# Altium schematic sheet BMS AFE - Thermistors.SchDoc: Title
size B; Organization: Midnight Sun Solar Rayce Car Team; Address1: University of Waterloo; Address2: 200 University Ave W; Address3: Waterloo, ON, Canada; Address4: N2L 3E9; DocumentNumber: 7; SheetNumber: 7; SheetTotal: 7; Website: www.uwmidsun.com; ProjectName: ProjectName
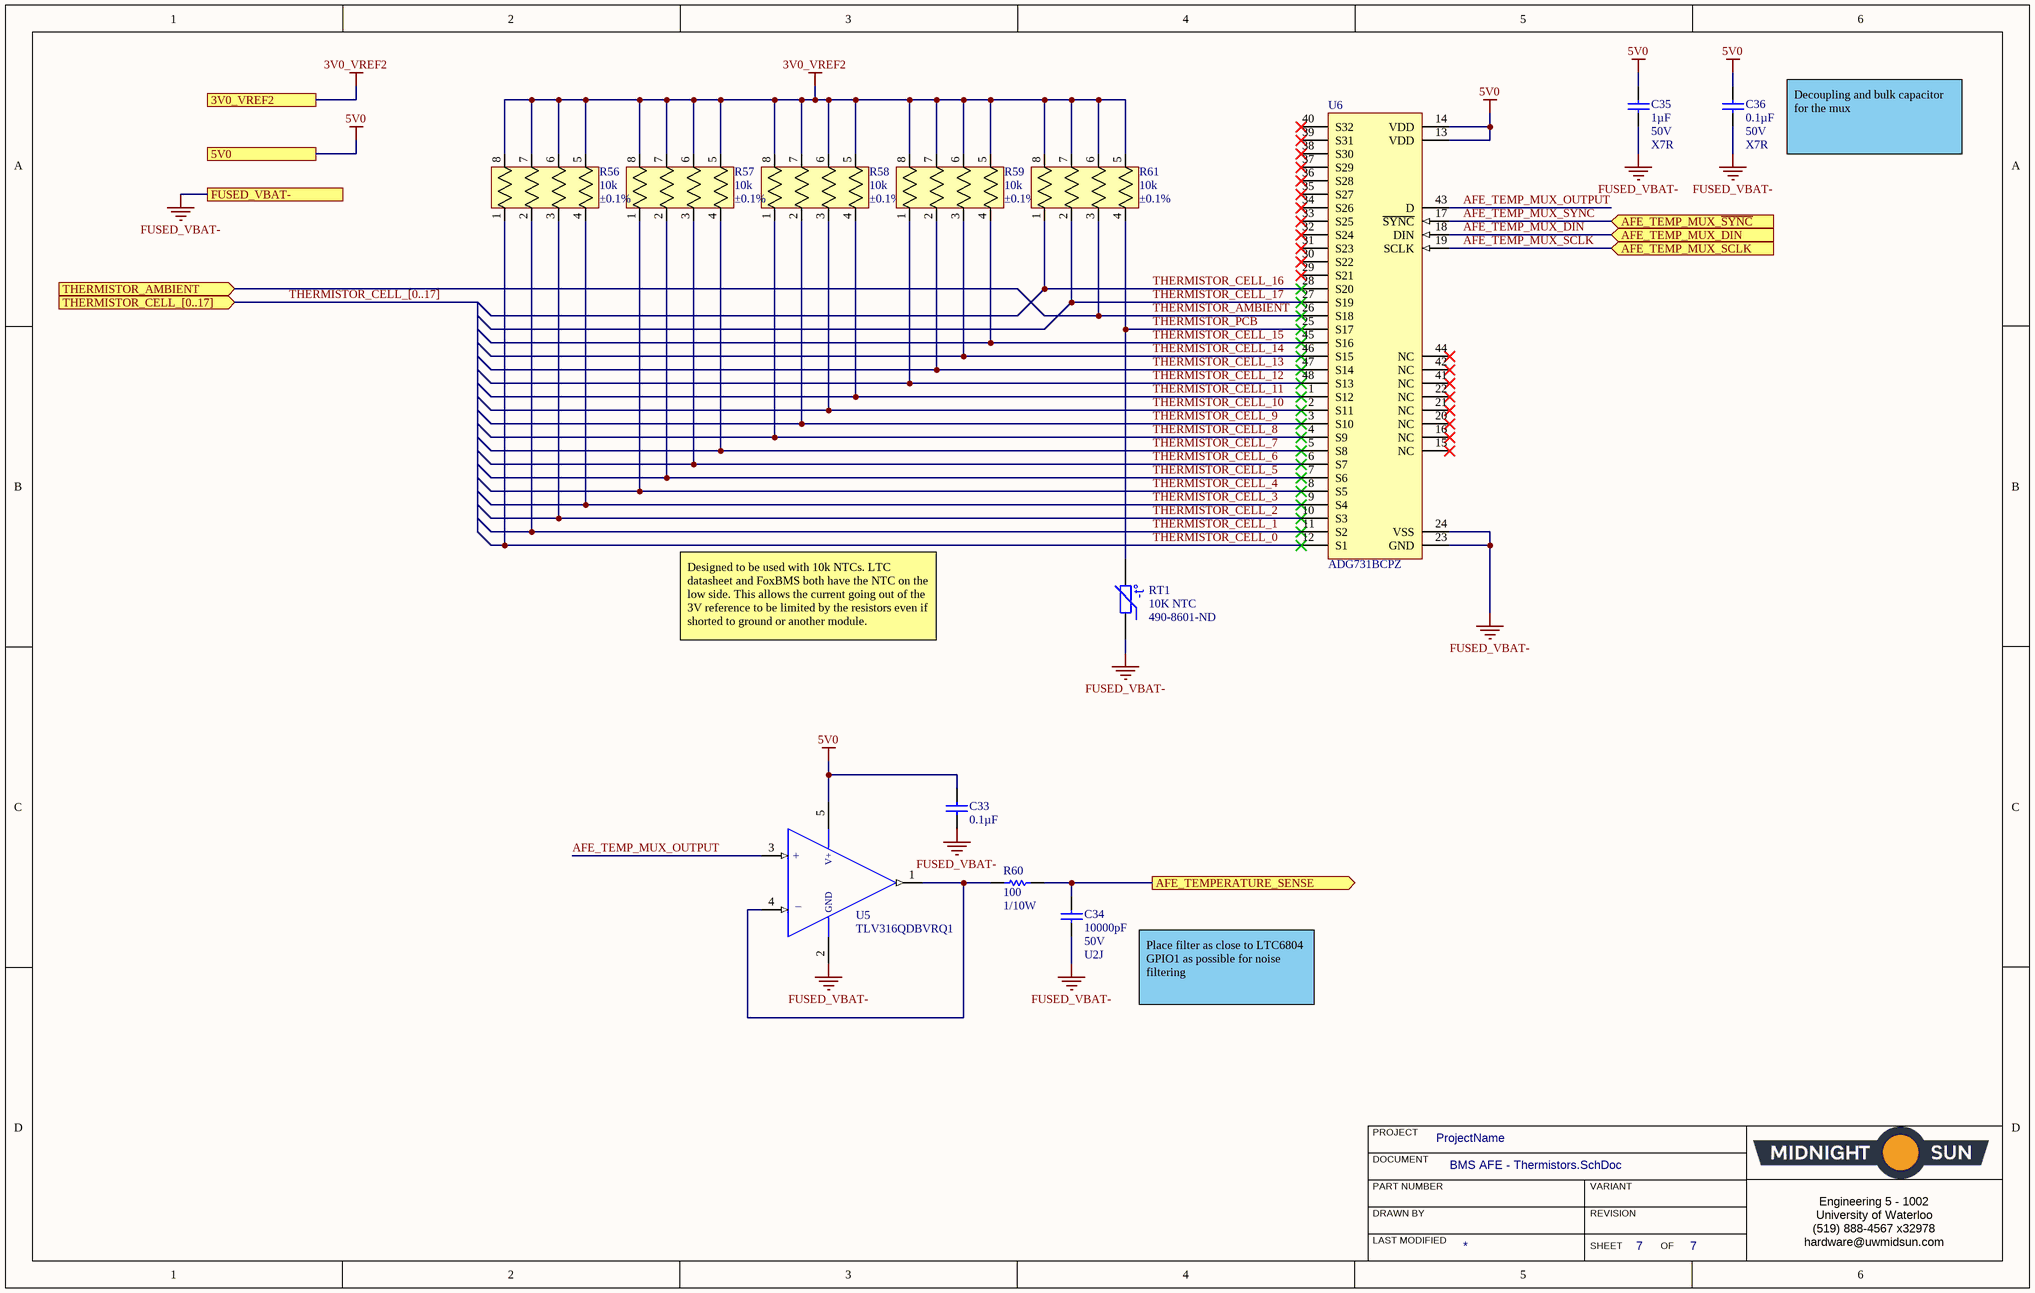
[diagram p0: BMS AFE - Thermistors.SchDoc]

## Parts
C33  Capacitance: 0.1µF  [CAP, 0603]  (hidden comment: CAP CER 0.1UF 50V 10% X7R 0603)
C34  Capacitance: 10000pF  Voltage: 50V  Temperature Coefficient: U2J  [CAP, 0603]  (hidden comment: CAP CER 10nF 50V 5% X7R 0603)
C35  Capacitance: 1µF  Voltage: 50V  Temperature Coefficient: X7R  [CAP, 0603]  (hidden comment: CAP CER 1UF 50V 10% X7R 0603)
C36  Capacitance: 0.1µF  Voltage: 50V  Temperature Coefficient: X7R  [CAP, 0603]  (hidden comment: CAP CER 0.1UF 50V 10% X7R 0603)
R56  Resistance (Ohms): 10k  Tolerance: ±0.1%  [RES ARRAY 4RES 1206]  (hidden comment: RES ARRAY 10K OHM 0.1% 4RES 1206)
R57  Resistance (Ohms): 10k  Tolerance: ±0.1%  [RES ARRAY 4RES 1206]  (hidden comment: RES ARRAY 10K OHM 0.1% 4RES 1206)
R58  Resistance (Ohms): 10k  Tolerance: ±0.1%  [RES ARRAY 4RES 1206]  (hidden comment: RES ARRAY 10K OHM 0.1% 4RES 1206)
R59  Resistance (Ohms): 10k  Tolerance: ±0.1%  [RES ARRAY 4RES 1206]  (hidden comment: RES ARRAY 10K OHM 0.1% 4RES 1206)
R60  Resistance: 100  Power: 1/10W  [RES, 0603]  (hidden comment: RES 100 OHM 1% 1/10W 0603)
R61  Resistance (Ohms): 10k  Tolerance: ±0.1%  [RES ARRAY 4RES 1206]  (hidden comment: RES ARRAY 10K OHM 0.1% 4RES 1206)
RT1  10K NTC  Supplier Part Number 1: 490-8601-ND  [NTC THERMISTOR BEAD]
U5  Manufacturer Part Number 1: TLV316QDBVRQ1  [IC OP AMP GP RR 10MHZ SOT-23-5]  (hidden comment: IC OP AMP GEN PURPOSE RR 10MHZ SOT-23-5)
U6  ADG731BCPZ  [TSQFP50P890X890X160-48M]

## Ports
3V0_VREF2, 5V0, AFE_TEMP_MUX_DIN (in), AFE_TEMP_MUX_SCLK (in), AFE_TEMP_MUX_~{SYNC} (in), AFE_TEMPERATURE_SENSE (out), FUSED_VBAT-, THERMISTOR_AMBIENT (in), THERMISTOR_CELL_[0..17] (in)

## Nets
3V0_VREF2: R56.5 R56.6 R56.7 R56.8 R57.5 R57.6 R57.7 R57.8 R58.5 R58.6 R58.7 R58.8 R59.5 R59.6 R59.7 R59.8 R61.5 R61.6 R61.7 R61.8 ; port 3V0_VREF2
5V0: C33.1 C35.1 C36.1 U5.5(VDD) U6.13(VDD) U6.14(VDD) ; port 5V0
FUSED_VBAT-: C33.2 C34.2 C35.2 C36.2 RT1.1 U5.2(VSS) U6.23(GND) U6.24(VSS) ; port FUSED_VBAT-
AFE_TEMP_MUX_DIN: U6.18(DIN) ; port AFE_TEMP_MUX_DIN
AFE_TEMP_MUX_OUTPUT: U5.3(+IN) U6.43(D)
AFE_TEMP_MUX_~{SYNC}: U6.17(~{SYNC}) ; port AFE_TEMP_MUX_~{SYNC}
AFE_TEMP_MUX_SCLK: U6.19(SCLK) ; port AFE_TEMP_MUX_SCLK
AFE_TEMPERATURE_SENSE: C34.1 R60.2 ; port AFE_TEMPERATURE_SENSE
THERMISTOR_AMBIENT: R61.3 U6.26(S18) ; port THERMISTOR_AMBIENT
THERMISTOR_CELL_0: R56.1 U6.12(S1)
THERMISTOR_CELL_1: R56.2 U6.11(S2)
THERMISTOR_CELL_2: R56.3 U6.10(S3)
THERMISTOR_CELL_3: R56.4 U6.9(S4)
THERMISTOR_CELL_4: R57.1 U6.8(S5)
THERMISTOR_CELL_5: R57.2 U6.7(S6)
THERMISTOR_CELL_6: R57.3 U6.6(S7)
THERMISTOR_CELL_7: R57.4 U6.5(S8)
THERMISTOR_CELL_8: R58.1 U6.4(S9)
THERMISTOR_CELL_9: R58.2 U6.3(S10)
THERMISTOR_CELL_10: R58.3 U6.2(S11)
THERMISTOR_CELL_11: R58.4 U6.1(S12)
THERMISTOR_CELL_12: R59.1 U6.48(S13)
THERMISTOR_CELL_13: R59.2 U6.47(S14)
THERMISTOR_CELL_14: R59.3 U6.46(S15)
THERMISTOR_CELL_15: R59.4 U6.45(S16)
THERMISTOR_CELL_16: R61.1 U6.28(S20)
THERMISTOR_CELL_17: R61.2 U6.27(S19)
THERMISTOR_PCB: R61.4 RT1.2 U6.25(S17)
NetR60_1: R60.1 U5.1(OUTPUT) U5.4(-IN)

Not connected (* = marked no-connect by the designer): U6 15(NC)* 16(NC)* 20(NC)* 21(NC)* 22(NC)* 29(S21)* 30(S22)* 31(S23)* 32(S24)* 33(S25)* 34(S26)* 35(S27)* 36(S28)* 37(S29)* 38(S30)* 39(S31)* 40(S32)* 41(NC)* 42(NC)* 44(NC)*

## Buses and harness runs
bus THERMISTOR_CELL_[0..17] = port THERMISTOR_CELL_[0..17]

## Notes on the sheet
- Decoupling and bulk capacitor for the mux
- Designed to be used with 10k NTCs. LTC datasheet and FoxBMS both have the NTC on the low side. This allows the current going out of the 3V reference to be limited by the resistors even if shorted to ground or another module.
- Place filter as close to LTC6804 GPIO1 as possible for noise filtering
- PROJECT
- DOCUMENT
- DRAWN BY
- LAST MODIFIED
- PART NUMBER
- REVISION
- SHEET
- VARIANT
- OF
- Engineering 5 - 1002
  University of Waterloo
  (519) 888-4567 x32978
  hardware@uwmidsun.com
- (in symbol IC OP AMP GEN PURPOSE RR 10MHZ SOT-23-5) V+; +; GND; _
- (in symbol NTC THERMISTOR 10K 1% BEAD) -t°

## Library data of the parts
C33 C36 = CAP CER 0.1UF 50V 10% X7R 0603: 0.10µF ±10% 50V Ceramic Capacitor X7R 0603 (1608 Metric); Manufacturer 1: AVX Corporation; Manufacturer Part Number 1: 06035C104KAT2A; Supplier 1: Digi-Key; Supplier Part Number 1: 478-5052-1-ND; Packaging: Cut Tape (CT); Part Status: Active; Operating Temperature: -55°C ~ 125°C; Ratings: -; Mounting Type: Surface Mount, MLCC; Package / Case: 0603 (1608 Metric); Size / Dimension: 0.063" L x 0.032" W (1.60mm x 0.81mm); Height - Seated (Max): -; Thickness (Max): 0.035" (0.90mm); Lead Spacing: -; Lead Style: -; ComponentLink1URL: http://datasheets.avx.com/X7RDielectric.pdf; ComponentLink1Description: http://datasheets.avx.com/X7RDielectric.pdf; Tolerance: ±10%
  C33: Voltage: 50V; Temperature Coefficient: X7R
C34 = CAP CER 10nF 50V 5% X7R 0603: 10000pF ±5% 50V Ceramic Capacitor U2J 0603 (1608 Metric); Manufacturer 1: KEMET; Manufacturer Part Number 1: C0603C103J5JAC7867; Supplier 1: Digi-Key; Supplier Part Number 1: 399-13384-1-ND; Packaging: Cut Tape (CT); Part Status: Active; Operating Temperature: -55°C ~ 125°C; Ratings: -; Failure Rate: -; Mounting Type: Surface Mount, MLCC; Package / Case: 0603 (1608 Metric); Size / Dimension: 0.063" L x 0.032" W (1.60mm x 0.80mm); Height - Seated (Max): -; Thickness (Max): 0.034" (0.87mm); Lead Spacing: -; Lead Style: -; ComponentLink1URL: http://www.kemet.com/docfinder?Partnumber=C0603C103J5JAC7867; ComponentLink1Description: http://www.kemet.com/docfinder?Partnumber=C0603C103J5JAC7867; Tolerance: ±5%
C35 = CAP CER 1UF 50V 10% X7R 0603: 1µF ±10% 50V Ceramic Capacitor X7R 0603 (1608 Metric); Manufacturer 1: Taiyo Yuden; Manufacturer Part Number 1: UMK107AB7105KA-T; Supplier 1: Digi-Key; Supplier Part Number 1: 587-3247-1-ND; Packaging: Cut Tape (CT); Part Status: Active; Operating Temperature: -55°C ~ 125°C; Ratings: -; Mounting Type: Surface Mount, MLCC; Package / Case: 0603 (1608 Metric); Size / Dimension: 0.063" L x 0.031" W (1.60mm x 0.80mm); Height - Seated (Max): -; Thickness (Max): 0.037" (0.95mm); Lead Spacing: -; Lead Style: -; ComponentLink1URL: http://www.yuden.co.jp/productdata/catalog/en/mlcc_all_e.pdf; ComponentLink1Description: http://www.yuden.co.jp/productdata/catalog/en/mlcc_all_e.pdf; Tolerance: ±10%
R56-R59 R61 = RES ARRAY 10K OHM 0.1% 4RES 1206: 10k Ohm ±0.1% 100mW Power Per Element Isolated 4 Resistor Network/Array ±25ppm/°C 1206 (3216 Metric), Convex, Long Side Terminals; Manufacturer: Vishay Beyschlag; Manufacturer Part Number: ACASA1002S1002P100; Number of Resistors: 4; Resistor Matching Ratio: ±0.05%; Resistor-Ratio-Drift: ±15 ppm/°C; Supplier 1: Digi-Key; RoHS: RoHS Compliant; Category: Resistors; Stock 1: 18780; Pricing 1: 1=1.19, 10=0.99, 25=0.8484, 50=0.7636, 100=0.6647, 250=0.59392, 500=0.4808 (CAD); Packaging: Cut Tape (CT); Part Status: Active; Circuit Type: Isolated; Power Per Element: 100mW; Temperature Coefficient: ±25ppm/°C; Operating Temperature: -55°C ~ 125°C; Applications: Voltage Divider (TCR Matched); Mounting Type: Surface Mount; Package / Case: 1206 (3216 Metric), Convex, Long Side Terminals; Supplier Device Package: 0612; Size / Dimension: 0.126" L x 0.059" W (3.20mm x 1.50mm); Height - Seated (Max): 0.022" (0.55mm); ComponentLink1URL: http://www.vishay.com/docs/28751/acasprec.pdf; ComponentLink1Description: http://www.vishay.com/docs/28751/acasprec.pdf; Supplier Part Number 1: 749-1023-1-ND
R60 = RES 100 OHM 1% 1/10W 0603: 100 Ohm ±1% 0.1W, 1/10W Chip Resistor 0603 (1608 Metric) Moisture Resistant Thick Film; Manufacturer 1: Yageo; Manufacturer Part Number 1: RC0603FR-07100RL; Temperature Coefficient: ±100ppm/°C; Supplier 1: Digi-Key; Supplier Part Number 1: 311-100HRCT-ND; Packaging: Cut Tape (CT); Part Status: Active; Composition: Thick Film; Operating Temperature: -55°C ~ 155°C; Package / Case: 0603 (1608 Metric); Supplier Device Package: 0603; Size / Dimension: 0.063" L x 0.031" W (1.60mm x 0.80mm); Height - Seated (Max): 0.022" (0.55mm); Failure Rate: -; ComponentLink1URL: http://www.yageo.com/documents/recent/PYu-RC_Group_51_RoHS_L_7.pdf; ComponentLink1Description: http://www.yageo.com/documents/recent/PYu-RC_Group_51_RoHS_L_7.pdf; Tolerance: ±1%
RT1 = NTC THERMISTOR 10K 1% BEAD: NTC Thermistor 10k Bead; Manufacturer: Murata Electronics North America; Manufacturer Part Number: NXRT15XH103FA1B030; Resistance Tolerance: ±1%; B25/50: 3380K; B25/85: 3434K; B25/100: 3455K; Supplier 1: Digi-Key; RoHS: RoHS Compliant; Category: Sensors, Transducers; Stock 1: 25017; Pricing 1: 1=0.96, 5=0.91, 10=0.792, 25=0.696, 50=0.5784, 100=0.4925, 500=0.42834, 1000=0.3748, 5000=0.33197 (CAD); Packaging: Bulk; Part Status: Active; Resistance in Ohms @ 25°C: 10k; B Value Tolerance: ±1%; B0/50: -; B25/75: -; Operating Temperature: -40°C ~ 125°C; Length - Lead Wire: -; Mounting Type: Through Hole; Package / Case: Bead; ComponentLink1URL: https://www.murata.com/~/media/webrenewal/support/library/catalog/products/thermistor/ntc/r44e.ashx; ComponentLink1Description: https://www.murata.com/~/media/webrenewal/support/library/catalog/products/thermistor/ntc/r44e.ashx
U5 = IC OP AMP GEN PURPOSE RR 10MHZ SOT-23-5: General Purpose Amplifier 1 Circuit Rail-to-Rail SOT-23-5; Manufacturer 1: Texas Instruments; Description 1: IC OP AMP GP RR 10MHZ 5-SOT-23; Number of Circuits: 1; Slew Rate: 6 V/µs; Current - Supply: 400µA; Current - Output / Channel: 50mA; Voltage - Supply, Single/Dual (±): 1.8 V ~ 5.5 V, ±0.9 V ~ 2.75 V; Supplier 1: Digi-Key; Supplier Part Number 1: 296-45323-1-ND; RoHS: RoHS Compliant; Category: Integrated Circuits (ICs); Stock 1: 1747; Pricing 1: 1=1.33, 10=1.185, 100=0.9234, 500=0.76276, 1000=0.60218 (CAD); Packaging: Cut Tape (CT); Part Status: Active; Amplifier Type: General Purpose; Output Type: Rail-to-Rail; -3db Bandwidth: -; Operating Temperature: -40°C ~ 125°C; Mounting Type: Surface Mount; Package / Case: SC-74A, SOT-753; Supplier Device Package: SOT-23-5; ComponentLink1URL: http://www.ti.com/lit/ds/symlink/tlv316-q1.pdf; ComponentLink1Description: http://www.ti.com/lit/ds/symlink/tlv316-q1.pdf
U6 = IC 32x1 Multiplexer ADG731BCPZ: IC MULTIPLEXER 32X1 48LFCSP; Manufacturer: Analog Devices Inc.; Manufacturer Part Number: ADG731BSUZ; Supplier 1: Digi-Key; Supplier Part Number 1: ADG731BSUZ-ND